# Altium schematic sheet Connectors.SchDoc
size A4; Organization: Altium Limited; Address1: L3, 12a Rodborough Rd; Address2: Frenchs Forest; Address3: NSW; Address4: Australia 2086
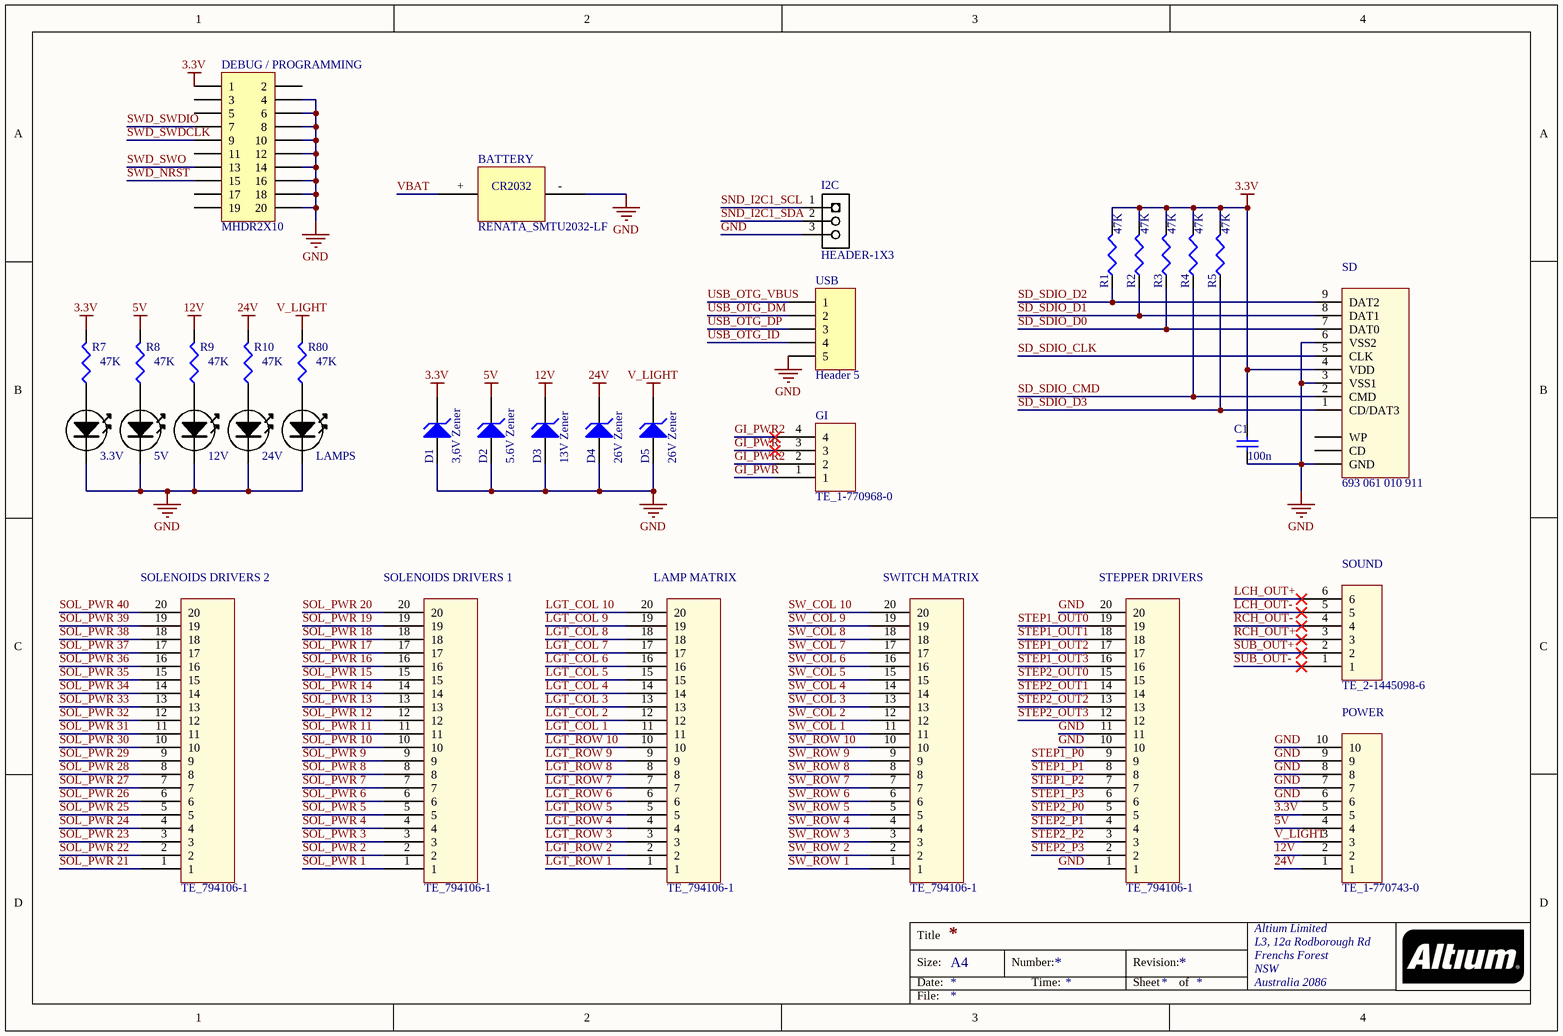
[diagram p0: Connectors.SchDoc]

## Parts
3.3V  LED-RED-3MM  [LED-3MM-RED]  (value not drawn)
5V  LED-RED-3MM  [LED-3MM-RED]  (value not drawn)
12V  LED-RED-3MM  [LED-3MM-RED]  (value not drawn)
24V  LED-RED-3MM  [LED-3MM-RED]  (value not drawn)
BATTERY  RENATA_SMTU2032-LF  [RENATA_SMTU2032-LF]
C1  value 100n  [0805C-GENERIC]  (hidden comment: Cap Semi)
D1  3,6V Zener  [DIODE-0.7]
D2  5.6V Zener  [DIODE-0.7]
D3  13V Zener  [DIODE-0.7]
D4  26V Zener  [DIODE-0.7]
D5  26V Zener  [DIODE-0.7]
DEBUG_/_PROGRAMMING  MHDR2X10  [IDC20-B]
GI  TE_1-770968-0  [TE_1-770968-0]
I2C  HEADER-1X3  [HEADER-1X3]
LAMP_MATRIX  TE_794106-1  [TE_794106-1]
LAMPS  LED-RED-3MM  [LED-3MM-RED]  (value not drawn)
POWER  TE_1-770743-0  [TE_1-770743-0]
R1  value 47K  [0805R-GENERIC]  (hidden comment: Res3)
R2  value 47K  [0805R-GENERIC]  (hidden comment: Res3)
R3  value 47K  [0805R-GENERIC]  (hidden comment: Res3)
R4  value 47K  [0805R-GENERIC]  (hidden comment: Res3)
R5  value 47K  [0805R-GENERIC]  (hidden comment: Res3)
R7  value 47K  [0805R-GENERIC]  (hidden comment: Res3)
R8  value 47K  [0805R-GENERIC]  (hidden comment: Res3)
R9  value 47K  [0805R-GENERIC]  (hidden comment: Res3)
R10  value 47K  [0805R-GENERIC]  (hidden comment: Res3)
R80  value 47K  [0805R-GENERIC]  (hidden comment: Res3)
SD  693 061 010 911  [693061010911]
SOLENOIDS_DRIVERS_1  TE_794106-1  [TE_794106-1]
SOLENOIDS_DRIVERS_2  TE_794106-1  [TE_794106-1]
SOUND  TE_2-1445098-6  [TE_2-1445098-6]
STEPPER_DRIVERS  TE_794106-1  [TE_794106-1]
SWITCH_MATRIX  TE_794106-1  [TE_794106-1]
USB  Header 5  [HEADER-1X5]

## Nets
3.3V: C1.2 D1.2(K) DEBUG_/_PROGRAMMING.1 POWER.5 R1.2 R2.2 R3.2 R4.2 R5.2 R7.2 SD.4(VDD)
5V: D2.2(K) POWER.4 R8.2
12V: D3.2(K) POWER.2 R9.2
24V: D4.2(K) POWER.1 R10.2
GND: 3.3V.K 5V.K 12V.K 24V.K BATTERY.- C1.1 D1.1(A) D2.1(A) D3.1(A) D4.1(A) D5.1(A) DEBUG_/_PROGRAMMING.4 DEBUG_/_PROGRAMMING.6 DEBUG_/_PROGRAMMING.8 DEBUG_/_PROGRAMMING.10 DEBUG_/_PROGRAMMING.12 DEBUG_/_PROGRAMMING.14 DEBUG_/_PROGRAMMING.16 DEBUG_/_PROGRAMMING.18 DEBUG_/_PROGRAMMING.20 I2C.3 LAMPS.K POWER.6 POWER.7 POWER.8 POWER.9 POWER.10 SD.3(VSS1) SD.6(VSS2) SD.GND STEPPER_DRIVERS.1 STEPPER_DRIVERS.10 STEPPER_DRIVERS.11 STEPPER_DRIVERS.20 USB.5
V_LIGHT: D5.2(K) POWER.3 R80.2
GI_PWR: GI.1 GI.3
GI_PWR2: GI.2 GI.4
LCH_OUT+: SOUND.6
LCH_OUT-: SOUND.5
LGT_COL 1: LAMP_MATRIX.11
LGT_COL 2: LAMP_MATRIX.12
LGT_COL 3: LAMP_MATRIX.13
LGT_COL 4: LAMP_MATRIX.14
LGT_COL 5: LAMP_MATRIX.15
LGT_COL 6: LAMP_MATRIX.16
LGT_COL 7: LAMP_MATRIX.17
LGT_COL 8: LAMP_MATRIX.18
LGT_COL 9: LAMP_MATRIX.19
LGT_COL 10: LAMP_MATRIX.20
LGT_ROW 1: LAMP_MATRIX.1
LGT_ROW 2: LAMP_MATRIX.2
LGT_ROW 3: LAMP_MATRIX.3
LGT_ROW 4: LAMP_MATRIX.4
LGT_ROW 5: LAMP_MATRIX.5
LGT_ROW 6: LAMP_MATRIX.6
LGT_ROW 7: LAMP_MATRIX.7
LGT_ROW 8: LAMP_MATRIX.8
LGT_ROW 9: LAMP_MATRIX.9
LGT_ROW 10: LAMP_MATRIX.10
RCH_OUT+: SOUND.3
RCH_OUT-: SOUND.4
SD_SDIO_CLK: SD.5(CLK)
SD_SDIO_CMD: R4.1 SD.2(CMD)
SD_SDIO_D0: R3.1 SD.7(DAT0)
SD_SDIO_D1: R2.1 SD.8(DAT1)
SD_SDIO_D2: R1.1 SD.9(DAT2)
SD_SDIO_D3: R5.1 SD.1(CD/DAT3)
SND_I2C1_SCL: I2C.1
SND_I2C1_SDA: I2C.2
SOL_PWR 1: SOLENOIDS_DRIVERS_1.1
SOL_PWR 2: SOLENOIDS_DRIVERS_1.2
SOL_PWR 3: SOLENOIDS_DRIVERS_1.3
SOL_PWR 4: SOLENOIDS_DRIVERS_1.4
SOL_PWR 5: SOLENOIDS_DRIVERS_1.5
SOL_PWR 6: SOLENOIDS_DRIVERS_1.6
SOL_PWR 7: SOLENOIDS_DRIVERS_1.7
SOL_PWR 8: SOLENOIDS_DRIVERS_1.8
SOL_PWR 9: SOLENOIDS_DRIVERS_1.9
SOL_PWR 10: SOLENOIDS_DRIVERS_1.10
SOL_PWR 11: SOLENOIDS_DRIVERS_1.11
SOL_PWR 12: SOLENOIDS_DRIVERS_1.12
SOL_PWR 13: SOLENOIDS_DRIVERS_1.13
SOL_PWR 14: SOLENOIDS_DRIVERS_1.14
SOL_PWR 15: SOLENOIDS_DRIVERS_1.15
SOL_PWR 16: SOLENOIDS_DRIVERS_1.16
SOL_PWR 17: SOLENOIDS_DRIVERS_1.17
SOL_PWR 18: SOLENOIDS_DRIVERS_1.18
SOL_PWR 19: SOLENOIDS_DRIVERS_1.19
SOL_PWR 20: SOLENOIDS_DRIVERS_1.20
SOL_PWR 21: SOLENOIDS_DRIVERS_2.1
SOL_PWR 22: SOLENOIDS_DRIVERS_2.2
SOL_PWR 23: SOLENOIDS_DRIVERS_2.3
SOL_PWR 24: SOLENOIDS_DRIVERS_2.4
SOL_PWR 25: SOLENOIDS_DRIVERS_2.5
SOL_PWR 26: SOLENOIDS_DRIVERS_2.6
SOL_PWR 27: SOLENOIDS_DRIVERS_2.7
SOL_PWR 28: SOLENOIDS_DRIVERS_2.8
SOL_PWR 29: SOLENOIDS_DRIVERS_2.9
SOL_PWR 30: SOLENOIDS_DRIVERS_2.10
SOL_PWR 31: SOLENOIDS_DRIVERS_2.11
SOL_PWR 32: SOLENOIDS_DRIVERS_2.12
SOL_PWR 33: SOLENOIDS_DRIVERS_2.13
SOL_PWR 34: SOLENOIDS_DRIVERS_2.14
SOL_PWR 35: SOLENOIDS_DRIVERS_2.15
SOL_PWR 36: SOLENOIDS_DRIVERS_2.16
SOL_PWR 37: SOLENOIDS_DRIVERS_2.17
SOL_PWR 38: SOLENOIDS_DRIVERS_2.18
SOL_PWR 39: SOLENOIDS_DRIVERS_2.19
SOL_PWR 40: SOLENOIDS_DRIVERS_2.20
STEP1_OUT0: STEPPER_DRIVERS.19
STEP1_OUT1: STEPPER_DRIVERS.18
STEP1_OUT2: STEPPER_DRIVERS.17
STEP1_OUT3: STEPPER_DRIVERS.16
STEP1_P0: STEPPER_DRIVERS.9
STEP1_P1: STEPPER_DRIVERS.8
STEP1_P2: STEPPER_DRIVERS.7
STEP1_P3: STEPPER_DRIVERS.6
STEP2_OUT0: STEPPER_DRIVERS.15
STEP2_OUT1: STEPPER_DRIVERS.14
STEP2_OUT2: STEPPER_DRIVERS.13
STEP2_OUT3: STEPPER_DRIVERS.12
STEP2_P0: STEPPER_DRIVERS.5
STEP2_P1: STEPPER_DRIVERS.4
STEP2_P2: STEPPER_DRIVERS.3
STEP2_P3: STEPPER_DRIVERS.2
SUB_OUT+: SOUND.2
SUB_OUT-: SOUND.1
SW_COL 1: SWITCH_MATRIX.11
SW_COL 2: SWITCH_MATRIX.12
SW_COL 3: SWITCH_MATRIX.13
SW_COL 4: SWITCH_MATRIX.14
SW_COL 5: SWITCH_MATRIX.15
SW_COL 6: SWITCH_MATRIX.16
SW_COL 7: SWITCH_MATRIX.17
SW_COL 8: SWITCH_MATRIX.18
SW_COL 9: SWITCH_MATRIX.19
SW_COL 10: SWITCH_MATRIX.20
SW_ROW 1: SWITCH_MATRIX.1
SW_ROW 2: SWITCH_MATRIX.2
SW_ROW 3: SWITCH_MATRIX.3
SW_ROW 4: SWITCH_MATRIX.4
SW_ROW 5: SWITCH_MATRIX.5
SW_ROW 6: SWITCH_MATRIX.6
SW_ROW 7: SWITCH_MATRIX.7
SW_ROW 8: SWITCH_MATRIX.8
SW_ROW 9: SWITCH_MATRIX.9
SW_ROW 10: SWITCH_MATRIX.10
SWD_NRST: DEBUG_/_PROGRAMMING.15
SWD_SWDCLK: DEBUG_/_PROGRAMMING.9
SWD_SWDIO: DEBUG_/_PROGRAMMING.7
SWD_SWO: DEBUG_/_PROGRAMMING.13
USB_OTG_DM: USB.2
USB_OTG_DP: USB.3
USB_OTG_ID: USB.4
USB_OTG_VBUS: USB.1
VBAT: BATTERY.+
Net3.3V_A: 3.3V.A R7.1
Net5V_A: 5V.A R8.1
Net12V_A: 12V.A R9.1
Net24V_A: 24V.A R10.1
NetLAMPS_A: LAMPS.A R80.1

Not connected (* = marked no-connect by the designer): DEBUG_/_PROGRAMMING 2 3 5 11 17 19; SD CD WP

## Notes on the sheet
- Title
- Size:
- Date:
- A4
- Number:
- Time:
- Revision:
- Sheet
- of
- File:
- (in symbol RENATA_SMTU2032-LF) CR2032

## Library data of the parts
C1 = Cap Semi: Capacitor (Semiconductor SIM Model); Published: 8-Jun-2000; LatestRevisionDate: 29-May-2009; LatestRevisionNote: IPC-7351 Footprint Added.; PackageReference: C1206; Publisher: Altium Limited; PackageDescription: Chip Capacitor
D1-D5 = D Zener: Zener Diode; Published: 8-Jun-2000; LatestRevisionDate: 17-Jul-2002; LatestRevisionNote: Re-released for DXP Platform.; PackageReference: DIODE-0.7; Publisher: Altium Limited; PackageDescription: Diode, Thru-Hole; 2 Leads; 0.7 in Pin Spacing
DEBUG_/_PROGRAMMING = MHDR2X10: Header, 10-Pin, Dual row; LatestRevisionDate: 17-Jul-2002; LatestRevisionNote: Re-released for DXP Platform.; Publisher: Altium Limited
R1-R5 R7-R10 R80 = Res3: Resistor; Published: 8-Jun-2000; LatestRevisionDate: 29-May-2009; LatestRevisionNote: IPC-7351 Footprint Added.; PackageReference: J1-0603; Publisher: Altium Limited; PackageDescription: Chip Resistor
SD = 503500-0991: SD Card Connector - Push & Push - With Card Detection / 9 pins; MF: Molex; MP: 503500-0991; Price: 2.91 USD; Package: FakePackage u; Availability: Good; Value: *
USB = Header 5: Header, 5-Pin; LatestRevisionDate: 17-Jul-2002; LatestRevisionNote: Re-released for DXP Platform.; Publisher: Altium Limited
I2C = HEADER-1X3: Supplier 1: Digi-Key; Supplier Part Number 1: S1011E-36-ND